# EAGLE schematic board (EAGLE 9.6.2)
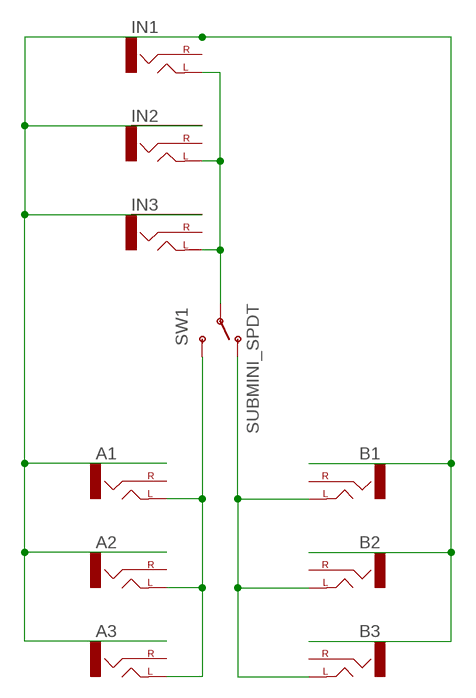
[diagram p0: schematic, sheet 1]

## Parts
A1  THONKI-STEREO  [WQP-PJ366ST_JACK]
A2  THONKI-STEREO  [WQP-PJ366ST_JACK]
A3  THONKI-STEREO  [WQP-PJ366ST_JACK]
B1  THONKI-STEREO  [WQP-PJ366ST_JACK]
B2  THONKI-STEREO  [WQP-PJ366ST_JACK]
B3  THONKI-STEREO  [WQP-PJ366ST_JACK]
IN1  THONKI-STEREO  [WQP-PJ366ST_JACK]
IN2  THONKI-STEREO  [WQP-PJ366ST_JACK]
IN3  THONKI-STEREO  [WQP-PJ366ST_JACK]
SW1  SUBMINI_SPDT  [SUBMINI_TOGGLE]

## Nets
N$1: A1.P$1_TIP(LEFT) A2.P$1_TIP(LEFT) A3.P$1_TIP(LEFT) SW1.3(S)
N$2: B1.P$1_TIP(LEFT) B2.P$1_TIP(LEFT) B3.P$1_TIP(LEFT) SW1.1(O)
N$3: IN1.P$1_TIP(LEFT) IN2.P$1_TIP(LEFT) IN3.P$1_TIP(LEFT) SW1.COM(COMMON)
N$4: A1.P$3_SLEEVE(SLEEVE) A2.P$3_SLEEVE(SLEEVE) A3.P$3_SLEEVE(SLEEVE) B1.P$3_SLEEVE(SLEEVE) B2.P$3_SLEEVE(SLEEVE) B3.P$3_SLEEVE(SLEEVE) IN1.P$3_SLEEVE(SLEEVE) IN2.P$3_SLEEVE(SLEEVE) IN3.P$3_SLEEVE(SLEEVE)
Unconnected: A1.P$2_SWITCH(RIGHT) A2.P$2_SWITCH(RIGHT) A3.P$2_SWITCH(RIGHT) B1.P$2_SWITCH(RIGHT) B2.P$2_SWITCH(RIGHT) B3.P$2_SWITCH(RIGHT) IN1.P$2_SWITCH(RIGHT) IN2.P$2_SWITCH(RIGHT) IN3.P$2_SWITCH(RIGHT)

## Library data of the parts
A1-A3 B1-B3 IN1-IN3 = MusicThingModular:THONKI-STEREO: 3.5mm socket for Eurorack modular synths
SW1 = MusicThingModular:SUBMINI_SPDT